# Altium project Conductivity.PrjPcb
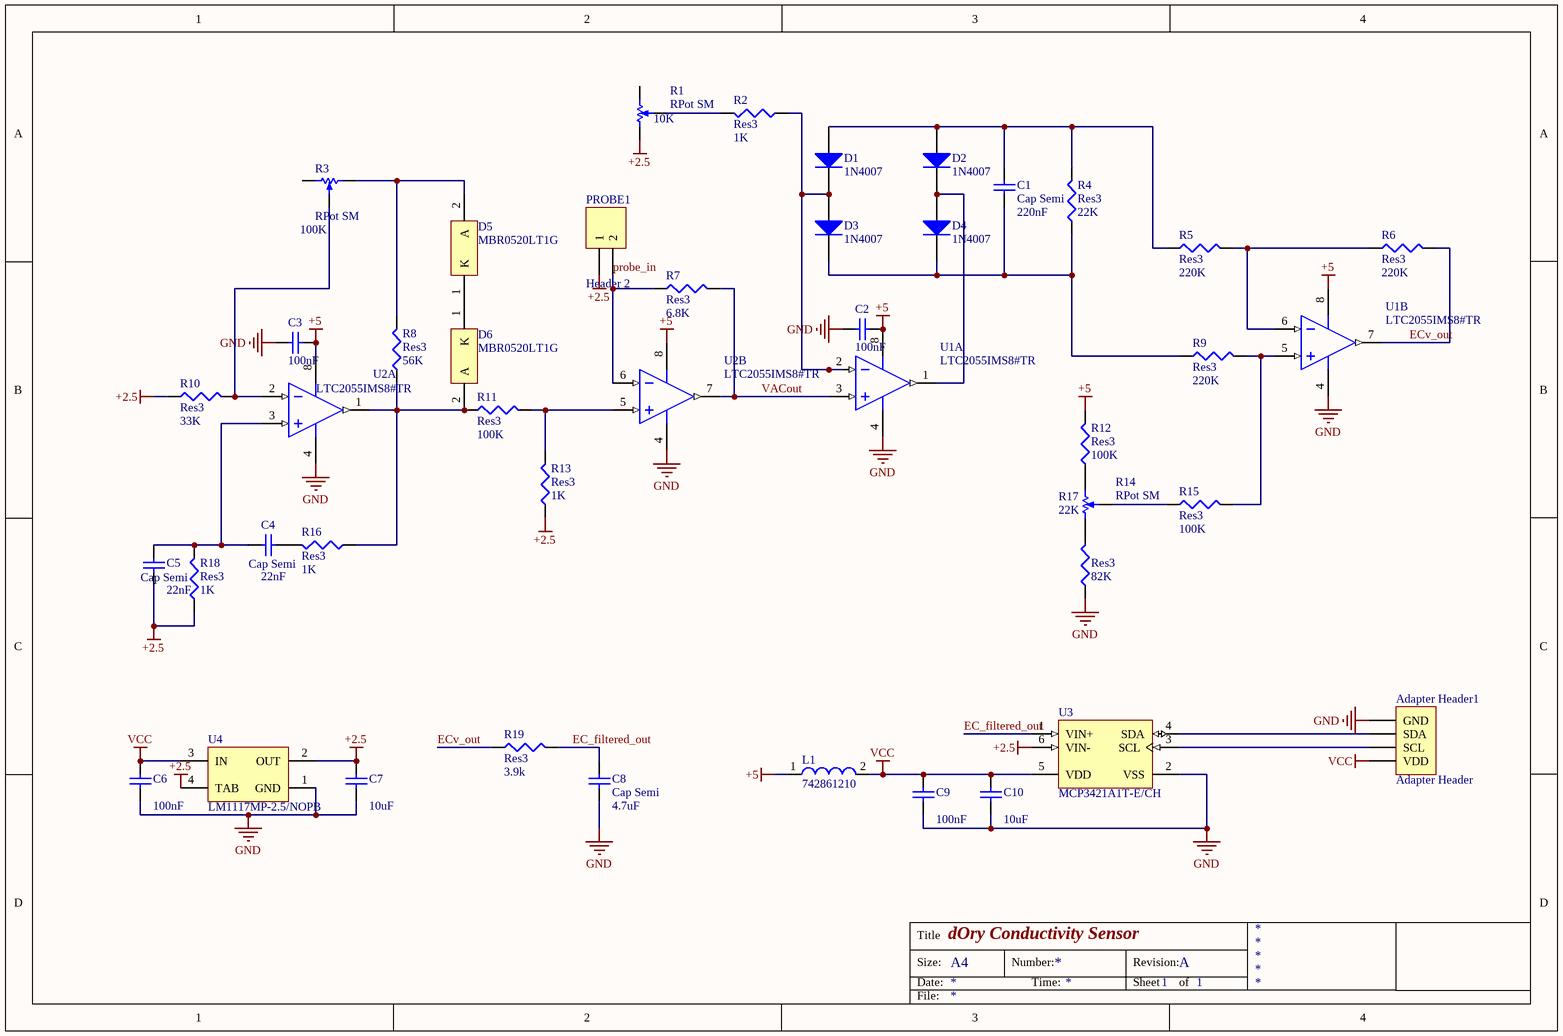
[diagram p0: Conductivity.SchDoc]
1 sheet, 43 parts. Net scope: global (net labels, ports and power ports of the same name join across sheets).
Board file: Conductivity.PcbDoc

## Sheet Conductivity.SchDoc: dOry Conductivity Sensor
size A4; DrawnBy: Raffael Tschui; Revision: A; SheetNumber: 1; SheetTotal: 1

### Parts
(Parts that share a designator on the sheet are numbered #1, #2 ... from top to bottom, then left to right.)
Adapter_Header1  Adapter Header  [Adapter Header]
C1  Cap Semi  value 220nF  [1608[0603]]
C2  value 100nF  [1608[0603]]  (hidden comment: Cap Semi)
C3  value 100nF  [1608[0603]]  (hidden comment: Cap Semi)
C4  Cap Semi  value 22nF  [1608[0603]]
C5  Cap Semi  value 22nF  [1608[0603]]
C6  value 100nF  [1608[0603]]  (hidden comment: Cap Semi)
C7  value 10uF  [1608[0603]]  (hidden comment: Cap Semi)
C8  Cap Semi  value 4.7uF  [1608[0603]]
C9  value 100nF  [1608[0603]]  (hidden comment: Cap Semi)
C10  value 10uF  [C1210]  (hidden comment: Cap Semi)
D1  1N4007  [VISH-DO-214AC-2_M]
D2  1N4007  [VISH-DO-214AC-2_M]
D3  1N4007  [VISH-DO-214AC-2_M]
D4  1N4007  [VISH-DO-214AC-2_M]
D5  MBR0520LT1G  [ONSC-SOD-123-2-425-04_V]
D6  MBR0520LT1G  [ONSC-SOD-123-2-425-04_V]
L1  742861210  [SMD-0603]
PROBE1  Header 2  [HDR1X2]
R1  RPot SM  value 10K  [POT4MM-2]
R2  Res3  value 1K  [J1-0603]
R3  RPot SM  value 100K  [POT4MM-2]
R4  Res3  value 22K  [J1-0603]
R5  Res3  value 220K  [J1-0603]
R6  Res3  value 220K  [J1-0603]
R7  Res3  value 6.8K  [J1-0603]
R8  Res3  value 56K  [J1-0603]
R9  Res3  value 220K  [J1-0603]
R10  Res3  value 33K  [J1-0603]
R11  Res3  value 100K  [J1-0603]
R12  Res3  value 100K  [J1-0603]
R13  Res3  value 1K  [J1-0603]
R14  RPot SM  value 22K  [POT4MM-2]
R15  Res3  value 100K  [J1-0603]
R16  Res3  value 1K  [J1-0603]
R17  Res3  value 82K  [J1-0603]
R18  Res3  value 1K  [J1-0603]
R19  Res3  value 3.9k  [J1-0603]
U1  LTC2055IMS8#TR  [LT-MS8-8_L]  (parts A,B of 2)
U2#1  LTC2055IMS8#TR  [LT-MS8-8_L]  (part B of 2)
U2#2  LTC2055IMS8#TR  [LT-MS8-8_L]  (part A of 2)
U3  MCP3421A1T-E/CH  [SOT-23-CH6_M]
U4  LM1117MP-2.5/NOPB  [MP04A_M]

### Nets
+2.5: C5.1 C7.2 PROBE1.1 R1.CCW(-) R10.1 R13.1 R18.1 U3.6(VIN-) U4.2(OUT) U4.4(TAB)
+5: C2.1 C3.1 L1.1 R12.2 U1.8(V+) U2#1.8(V+) U2#2.8(V+)
GND: Adapter_Header1.1(GND) C2.2 C3.2 C6.1 C7.1 C8.1 C9.1 C10.1 R17.1 U1.4(V-) U2#1.4(V-) U2#2.4(V-) U3.2(VSS) U4.1(GND)
VCC: Adapter_Header1.4(VDD) C6.2 C9.2 C10.2 L1.2 U3.5(VDD) U4.3(IN)
EC_filtered_out: C8.2 R19.2 U3.1(VIN+)
ECv_out: R6.2 R19.1 U1.7(OUT_B)
probe_in: PROBE1.2 R7.1 U2#1.6(-IN_B)
VACout: R7.2 U1.3(+IN_A) U2#1.7(OUT_B)
NetAdapter_Header1_2: Adapter_Header1.2(SDA) U3.4(SDA)
NetAdapter_Header1_3: Adapter_Header1.3(SCL) U3.3(SCL)
NetC1_1: C1.1 D3.1(K) D4.1(K) R4.1 R9.1
NetC1_2: C1.2 D1.2(A) D2.2(A) R4.2 R5.1
NetC4_1: C4.1 C5.2 R18.2 U2#2.3(+IN_A)
NetC4_2: C4.2 R16.2
NetD1_1: D1.1(K) D3.2(A) R2.1 U1.2(-IN_A)
NetD2_1: D2.1(K) D4.2(A) U1.1(OUT_A)
NetD5_1: D5.1(K) D6.1(K)
NetD5_2: D5.2(A) R3.CW(+) R8.2
NetD6_2: D6.2(A) R8.1 R11.1 R16.1 U2#2.1(OUT_A)
NetR1_W: R1.W R2.2
NetR3_W: R3.W R10.2 U2#2.2(-IN_A)
NetR5_2: R5.2 R6.1 U1.6(-IN_B)
NetR9_2: R9.2 R15.2 U1.5(+IN_B)
NetR11_2: R11.2 R13.2 U2#1.5(+IN_B)
NetR12_1: R12.1 R14.CW(+)
NetR14_CCW: R14.CCW(-) R17.2
NetR14_W: R14.W R15.1

Not connected (* = marked no-connect by the designer): R1 CW(+); R3 CCW(-)

### Notes on the sheet
- Title
- Size:
- Date:
- A4
- Number:
- Time:
- Revision:
- Sheet
- of
- File:

### Library data of the parts
Adapter_Header1 = Adapter Header: Header, 4-Pin; LatestRevisionDate: 17-Jul-2002; LatestRevisionNote: Re-released for DXP Platform.; Publisher: Altium Limited
C1-C10 = Cap Semi: Capacitor (Semiconductor SIM Model); Published: 8-Jun-2000; LatestRevisionDate: 29-May-2009; LatestRevisionNote: IPC-7351 Footprint Added.; PackageReference: C1206; Publisher: Altium Limited; PackageDescription: Chip Capacitor
D1-D4 = CMP-0548-00220-2: Transient Voltage Suppressor, 6.40 to 231 V, 188 V Stand-off Voltage, Uni-Directional, -55 to 155 degC, 2-pin DO-214AC, Pb-Free, Tape and Reel; PartNumber: SMAJ188A-E3/61; Manufacturer: Vishay Semiconductor; VWM (V): 188; IFSM: 40 A; VBR Uni-Directional (V): 6.4 to 231; ID (uA): 1; PPPM (W): 400, 300; ComponentLink2URL: http://www.vishay.com/docs/88390/smaj50a.pdf; Operating Junction and Storage Temperature Range: -55 to 150 degC; DatasheetVersion: 12/8/2013; PackageDescription: 2-Pin DO-214AC (SMA), Body 4.245 x 2.665 mm; ComponentLink1Description: Manufacturer URL; ComponentLink2Description: Datasheet; ComponentLink3URL: http://www.vishay.com/docs/88390/smaj50a.pdf; ComponentLink3Description: Package Specification; PackageReference: DO-214AC-2; Mounting Technology: Surface Mount; ComponentLink1URL: http://www.vishay.com/; Packing: Tape and Reel; RoHS: TRUE
D5 D6 = CMP-1055-00425-1: Schottky Power Rectifier, 2-Pin SOD-123, Pb-Free, Tape and Reel; Manufacturer: On Semiconductor; IFSM Max (A): 5.5; Configuration: Single; ComponentLink2Description: Datasheet; RoHS: TRUE; PartNumber: MBR0520LT1G; PackageVersion: Rev. G, 10/2009; DatasheetVersion: Rev. 6; PackageReference: SOD-123-2-425-04; ComponentLink2URL: http://www.onsemi.cn/pub_link/Collateral/MBR0520LT1-D.PDF; ComponentLink3Description: Package Specification; ComponentLink1URL: http://www.onsemi.com/; ComponentLink3URL: http://www.onsemi.com/pub_link/Collateral/425-04.PDF; ComponentLink1Description: Manufacturer URL; PackageDescription: 2-Pin SOD, Body 1.6 x 2.69 mm; Packing: Tape and Reel; Mounting Technology: Surface Mount
L1 = CMP-0220-00121-1: SMD EMI Suppression Ferrite Bead WE-CBF HF, Z = 1000 Ohm; PackageDescription: Chip Inductor, 2-Leads, Body 1.6 x 0.8 mm; PackageReference: SMD-0603; DatasheetVersion: ver 2, Aug-2009; ComponentLink2Description: Datasheet; ComponentLink1Description: Manufacturer Link; Impedance: 1000 Ohm; PackageVersion: 2009; ComponentLink2URL: http://www.we-online.de/katalog/media/pdf/742861210.pdf; ComponentLink1URL: http://www.we-online.com
PROBE1 = Header 2: Header, 2-Pin; LatestRevisionDate: 17-Jul-2002; LatestRevisionNote: Re-released for DXP Platform.; Publisher: Altium Limited
R1 R3 R14 = RPot SM: Square Trimming Potentiometer; Published: 17-Dec-2003; DatasheetVersion: Oct-2003; PackageReference: POT4MM-2; Publisher: Altium Limited; PackageDescription: Square Trimming Potentiometer; ComponentLink1Description: Manufacturer Link; ComponentLink1URL: http://bourns.com/2/search.html
R2 R4-R13 R15-R19 = Res3: Resistor; Published: 8-Jun-2000; LatestRevisionDate: 29-May-2009; LatestRevisionNote: IPC-7351 Footprint Added.; PackageReference: J1-0603; Publisher: Altium Limited; PackageDescription: Chip Resistor
U1 U2#1 U2#2 = CMP-0359-00930-2: Dual Channel, Micropower Zero-Drift Operational Amplifier, 0.5 MHz Typical GBW, 0.5 V/us Typical SR, 2.7 to 6 V, 8-Pin SOP (MS8-8), Industrial, Reel; Manufacturer: Linear Technology; GBW (MHz) Typical: 0.5; Vs Min (V): 2.7; Channels (#): 2; Is (mA) Typical: 0.135; Vs Max (V): 6; Vos (mV) Typical: 0.0005; PackageDescription: 8-Lead Plastic Small Outline, Body 3.9 x 4.9 mm, Pitch 1.27 mm; Type: ZD; ComponentLink2URL: http://cds.linear.com/docs/en/datasheet/20545fc.pdf; PartNumber: LTC2055IMS8#TR; RevisionNote: URLs updated; Packing: Reel; ComponentLink2Description: Datasheet; DatasheetVersion: Rev. C; ComponentLink3URL: http://cds.linear.com/docs/en/packaging/05081610_G_SO8.pdf; ComponentLink3Description: Package Specification; ComponentLink1URL: http://www.linear.com/; PackageReference: LT-MS8-8; PackageVersion: Rev G; ComponentLink1Description: Manufacturer URL; Mounting Technology: Surface Mount; SR (V/us) Typical: 0.5; Linear Technology Part Number: LTC2055
U3 = CMP-0188-00757-2: 18-Bit Analog-to-Digital Converter with I2C Interface and On-Board Reference, 6-Pin SOT-23, Extended Temperature, Tape and Reel; ComponentLink1URL: http://www.microchip.com/; ComponentLink3Description: Package Specification; PackageDescription: 6-Lead Plastic Small Outline Transistor (CH) [SOT-23]; ComponentLink2URL: http://ww1.microchip.com/downloads/en/DeviceDoc/22003e.pdf; ComponentLink2Description: Datasheet; PackageReference: SOT-23-CH6; PackageVersion: revBB, Aug-2009; RevisionNote: URLs added.; Code_IPC: SOT26A-6; ComponentLink1Description: Manufacturer URL; DatasheetVersion: revE, Aug-2009; ComponentLink3URL: http://www.microchip.com/stellent/groups/techpub_sg/documents/packagingspec/en012702.pdf
U4 = CMP-0062-01660-2: 800mA Low-Dropout Linear Regulator, 4-pin SOT-223, Pb-Free; Manufacturer: National Semiconductor; PackageTopMarking: XYTT*N13A; CompType: LDO IC; PowerWise: N; ComponentLink2Description: LM1117 Web Page; ComponentLink2URL: http://www.national.com/pf/LM/LM1117.html; ComponentLink1URL: http://www.national.com/ds/LM/LM1117.pdf; PackageVersion: revB, Apr-2003; PinCount: 4; PackageReference: MP04A; RoHS: Y; DatasheetVersion: Apr-2006; PackageDescription: Molded SOT-223, 6.50 x 3.56 x 1.6mm Body, 4 Lead, 2.3mm Pitch; Code_JEDEC: TO-261-AA; ComponentLink3Description: MP04A Package Page; RevisionNote: Component URLs added; ComponentLink3URL: http://www.national.com/packaging/folders/mp04a.html; Code_IPC: SOT223-4; ComponentLink1Description: LM1117 Datasheet